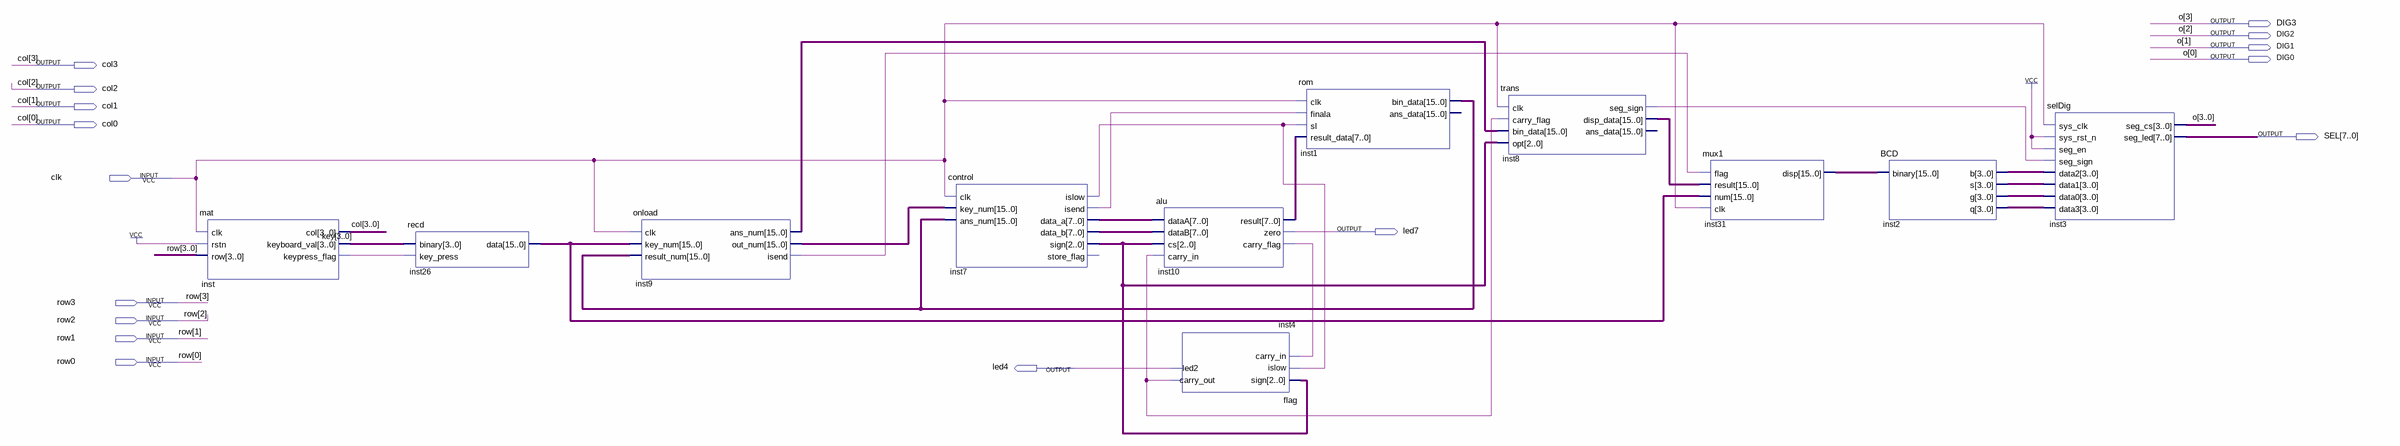
[diagram p0: schematic sheet]
// Quartus schematic Block1.bdf as structural Verilog: 11 symbols, 16 pins
module Block1 (
  input  clk,
  input  row3,
  input  row2,
  input  row1,
  input  row0,
  output DIG3,
  output DIG2,
  output DIG1,
  output DIG0,
  output col3,
  output col2,
  output col1,
  output col0,
  output [7:0] SEL,
  output led7,
  output led4
);

  wire inst4_carry_out, inst7_isend, inst7_islow, inst8_seg_sign, inst9_isend, inst10_carry_flag,
       inst_keypress_flag;
  wire [2:0] inst7_sign;
  wire [3:0] inst2_b, inst2_g, inst2_q, inst2_s, key;
  wire [7:0] inst7_data_a, inst7_data_b, inst10_result;
  wire [15:0] inst1_bin_data, inst8_disp_data, inst9_ans_num, inst9_out_num, inst26_data, inst31_disp;

  mat inst (
    .clk(clk), .rstn(1'b1), .row({row3, row2, row1, row0}), .col({col3, col2, col1, col0}),
    .keyboard_val(key), .keypress_flag(inst_keypress_flag));
  recd inst26 (.binary(key), .key_press(inst_keypress_flag), .data(inst26_data));
  onload inst9 (
    .clk(clk), .key_num(inst26_data), .result_num(inst1_bin_data), .ans_num(inst9_ans_num),
    .out_num(inst9_out_num), .isend(inst9_isend));
  control inst7 (
    .clk(clk), .key_num(inst9_out_num), .ans_num(inst1_bin_data), .islow(inst7_islow), .isend(inst7_isend),
    .data_a(inst7_data_a), .data_b(inst7_data_b), .sign(inst7_sign));  // open: store_flag
  alu inst10 (
    .dataA(inst7_data_a), .dataB(inst7_data_b), .cs(inst7_sign), .carry_in(inst4_carry_out),
    .result(inst10_result), .zero(led7), .carry_flag(inst10_carry_flag));
  flag inst4 (
    .sign(inst7_sign), .islow(inst7_islow), .carry_in(inst10_carry_flag), .carry_out(inst4_carry_out),
    .led2(led4));
  rom inst1 (
    .clk(clk), .finala(inst7_isend), .sl(inst7_islow), .result_data(inst10_result), .bin_data(inst1_bin_data));  // open: ans_data
  trans inst8 (
    .clk(clk), .carry_flag(inst4_carry_out), .bin_data(inst9_ans_num), .opt(inst7_sign),
    .seg_sign(inst8_seg_sign), .disp_data(inst8_disp_data));  // open: ans_data
  mux1 inst31 (.flag(inst9_isend), .result(inst8_disp_data), .num(inst26_data), .clk(clk), .disp(inst31_disp));
  BCD inst2 (.binary(inst31_disp), .b(inst2_b), .s(inst2_s), .g(inst2_g), .q(inst2_q));
  selDig inst3 (
    .sys_clk(clk), .sys_rst_n(1'b1), .seg_en(1'b1), .seg_sign(inst8_seg_sign), .data2(inst2_b),
    .data1(inst2_s), .data0(inst2_g), .data3(inst2_q), .seg_cs({DIG3, DIG2, DIG1, DIG0}), .seg_led(SEL));

  // Other names for the same wires on the sheet: o[3:0] = {DIG3, DIG2, DIG1, DIG0}
endmodule
